# Altium schematic sheet VolumeMeter.SchDoc
size A
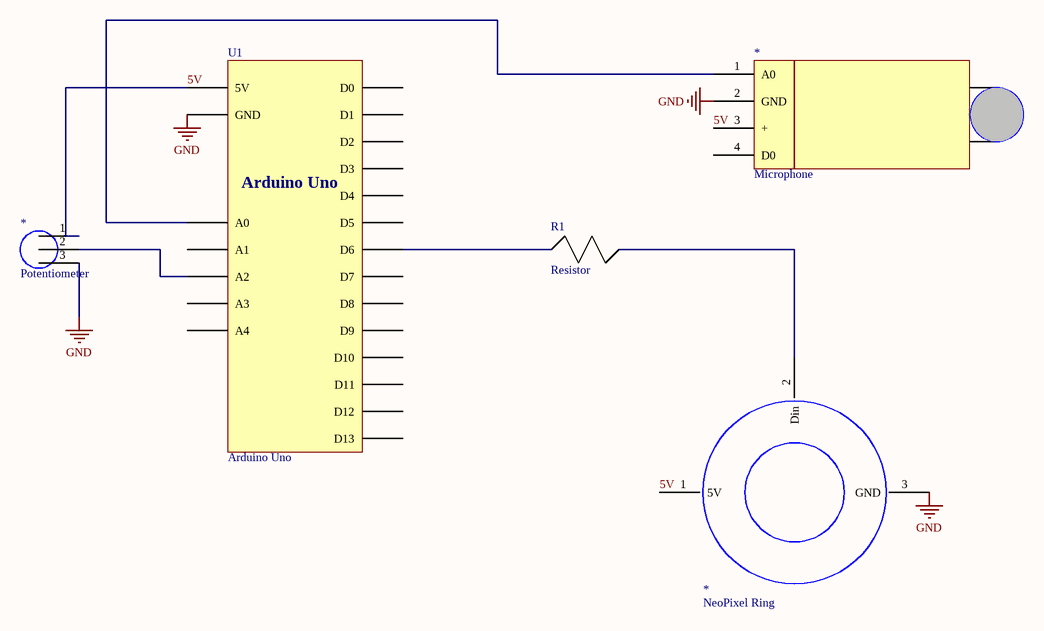
[diagram p0: VolumeMeter.SchDoc]

## Parts
(Parts that share a designator on the sheet are numbered #1, #2 ... from top to bottom, then left to right.)
*#1  Microphone
*#2  Potentiometer
*#3  NeoPixel Ring
R1  Resistor
U1  Arduino Uno

## Nets
GND: *#1.2(GND) *#3.3(GND) U1.2(GND)
5V: *#1.3(+) *#3.1(5V) U1.1(5V)
Net*#1_1: *#1.1(A0) U1.2(A0)
Net*#3_2: *#3.2(Din) R1.55
NetR1_54: R1.54 U1.13(D6)

Not connected (* = marked no-connect by the designer): *#1 4(D0); *#2 1(35) 2(36) 3(37); U1 3(A1) 4(A2) 5(A3) 6(A4) 7(D0) 8(D1) 9(D2) 10(D3) 11(D4) 12(D5) 14(D7) 15(D8) 16(D9) 17(D10) 18(D11) 19(D13)